# Altium schematic sheet LPDDR4X.SchDoc
size A3; SheetNumber: 11; SheetTotal: 35
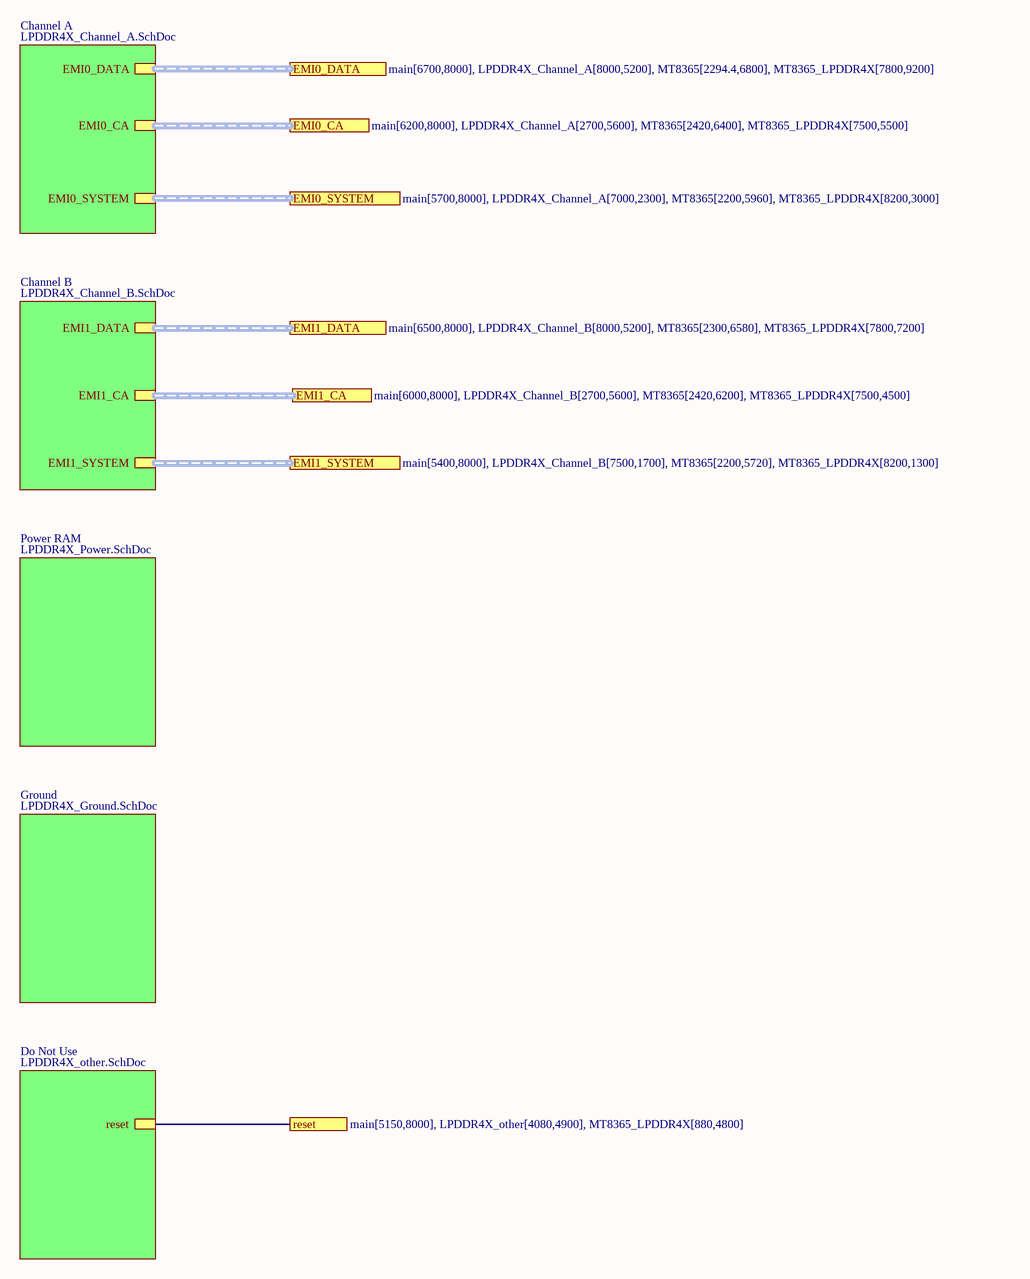
[diagram p0: LPDDR4X.SchDoc]

## Sub-sheets
Channel A = LPDDR4X_Channel_A.SchDoc: EMI0_DATA, EMI0_CA, EMI0_SYSTEM
Channel B = LPDDR4X_Channel_B.SchDoc: EMI1_DATA, EMI1_CA, EMI1_SYSTEM
Do Not Use = LPDDR4X_other.SchDoc: reset
Ground = LPDDR4X_Ground.SchDoc: no entries
Power RAM = LPDDR4X_Power.SchDoc: no entries

## Ports
EMI0_CA (see main[6200,8000], LPDDR4X_Channel_A[2700,5600], MT8365[2420,6400], MT8365_LPDDR4X[7500,5500]), EMI0_DATA (see main[6700,8000], LPDDR4X_Channel_A[8000,5200], MT8365[2294.4,6800], MT8365_LPDDR4X[7800,9200]), EMI0_SYSTEM (see main[5700,8000], LPDDR4X_Channel_A[7000,2300], MT8365[2200,5960], MT8365_LPDDR4X[8200,3000]), EMI1_CA (see main[6000,8000], LPDDR4X_Channel_B[2700,5600], MT8365[2420,6200], MT8365_LPDDR4X[7500,4500]), EMI1_DATA (see main[6500,8000], LPDDR4X_Channel_B[8000,5200], MT8365[2300,6580], MT8365_LPDDR4X[7800,7200]), EMI1_SYSTEM (see main[5400,8000], LPDDR4X_Channel_B[7500,1700], MT8365[2200,5720], MT8365_LPDDR4X[8200,1300]), reset (see main[5150,8000], LPDDR4X_other[4080,4900], MT8365_LPDDR4X[880,4800])

## Nets
reset: port reset, sheet Do Not Use/reset

## Buses and harness runs
harness port EMI0_CA = sheet Channel A/EMI0_CA
harness port EMI0_DATA = sheet Channel A/EMI0_DATA
harness port EMI0_SYSTEM = sheet Channel A/EMI0_SYSTEM
harness port EMI1_CA = sheet Channel B/EMI1_CA
harness port EMI1_DATA = sheet Channel B/EMI1_DATA
harness port EMI1_SYSTEM = sheet Channel B/EMI1_SYSTEM